# EasyEDA schematic SCH_Hytroponic_2022-08-30.json
TITLE: Sheet_1; REV: 1.0; Date: 2022-08-27; Sheet: 1/1; Drawn By: lykeosovandara4; Company: Your Company
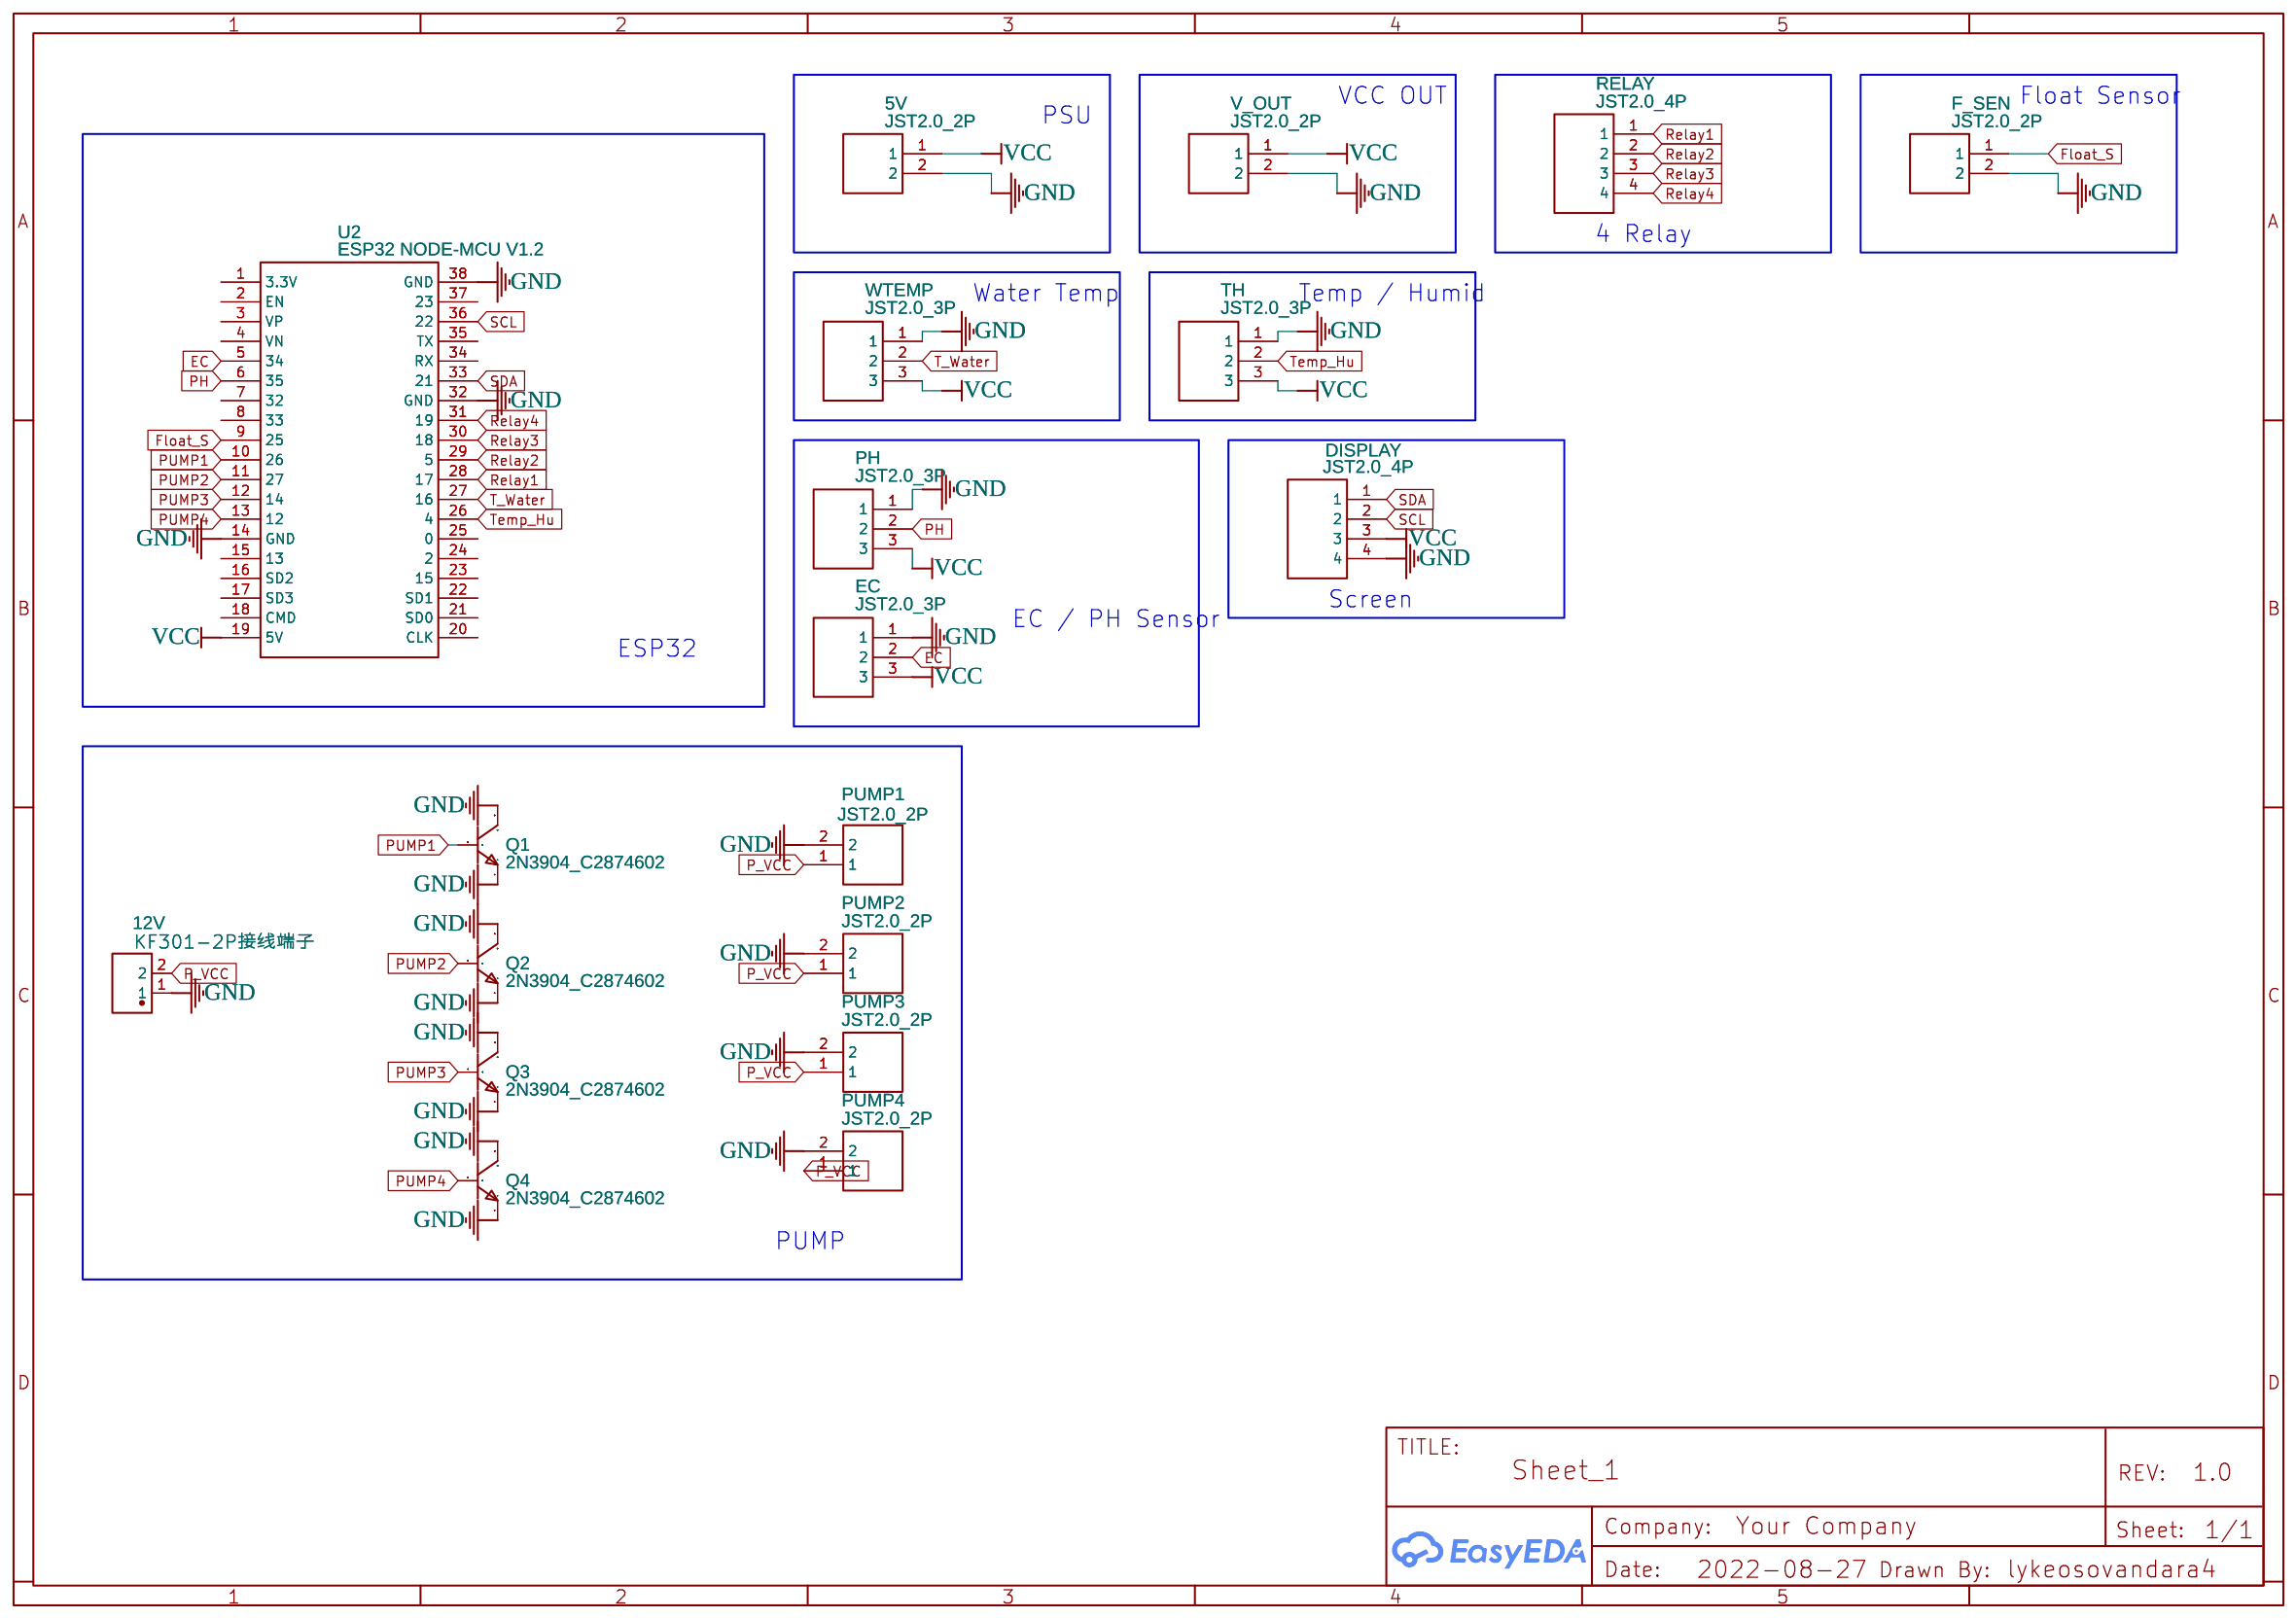
[diagram p0: schematic sheet]

## Parts
5V  JST2.0_2P  [JST2.0_2P]
12V  KF301-2P接线端子  [CONN-TH_XY301V-A-5.0-2P]
DISPLAY  JST2.0_4P  [JST2.0_4P]
EC  JST2.0_3P  [JST2.0_3P]
F_SEN  JST2.0_2P  [JST2.0_2P]
PH  JST2.0_3P  [JST2.0_3P]
PUMP1  JST2.0_2P  [JST2.0_2P]
PUMP2  JST2.0_2P  [JST2.0_2P]
PUMP3  JST2.0_2P  [JST2.0_2P]
PUMP4  JST2.0_2P  [JST2.0_2P]
Q1  2N3904_C2874602  [TO-92-3_L4.6-W3.6-P1.30-L_2N3904]
Q2  2N3904_C2874602  [TO-92-3_L4.6-W3.6-P1.30-L_2N3904]
Q3  2N3904_C2874602  [TO-92-3_L4.6-W3.6-P1.30-L_2N3904]
Q4  2N3904_C2874602  [TO-92-3_L4.6-W3.6-P1.30-L_2N3904]
RELAY  JST2.0_4P  [JST2.0_4P]
TH  JST2.0_3P  [JST2.0_3P]
U2  ESP32 NODE-MCU V1.2  [ESP32 NODE-MCU V1.2]
V_OUT  JST2.0_2P  [JST2.0_2P]
WTEMP  JST2.0_3P  [JST2.0_3P]

## Library data of the parts
5V F_SEN PUMP1-PUMP4 V_OUT = JST2.0_2P: Contributor: chentodd2012
12V = KF301-2P接线端子: Supplier: LCSC; Supplier Part: C9900016950; Manufacturer: null; JLCPCB Part Class: Extended Part; Contributor: lcsc
DISPLAY RELAY = JST2.0_4P: Contributor: chentodd2012
EC PH TH WTEMP = JST2.0_3P: Contributor: chentodd2012
Q1-Q4 = 2N3904_C2874602: Supplier: LCSC; Supplier Part: C2874602; Manufacturer: JSMSEMI(杰盛微); Manufacturer Part: 2N3904; Contributor: LCSC; JLCPCB Part Class: Extended Part
U2 = ESP32 NODE-MCU V1.2: Manufacturer: AI-THINKER; Contributor: somsaklai

## Nets
GND: 5V.2 12V.1 DISPLAY.4 EC.1 F_SEN.2 PH.1 PUMP1.2 PUMP2.2 PUMP3.2 PUMP4.2 Q1.1(E) Q1.3(C) Q2.1(E) Q2.3(C) Q3.1(E) Q3.3(C) Q4.1(E) Q4.3(C) TH.1 U2.14(GND) U2.32(GND) U2.38(GND) V_OUT.2 WTEMP.1
VCC: 5V.1 DISPLAY.3 EC.3 PH.3 TH.3 U2.19(5V) V_OUT.1 WTEMP.3
EC: EC.2 U2.5(34)
Float_S: F_SEN.1 U2.9(25)
P_VCC: 12V.2 PUMP1.1 PUMP2.1 PUMP3.1 PUMP4.1
PH: PH.2 U2.6(35)
PUMP1: Q1.2(B) U2.10(26)
PUMP2: Q2.2(B) U2.11(27)
PUMP3: Q3.2(B) U2.12(14)
PUMP4: Q4.2(B) U2.13(12)
Relay1: RELAY.1 U2.28(17)
Relay2: RELAY.2 U2.29(5)
Relay3: RELAY.3 U2.30(18)
Relay4: RELAY.4 U2.31(19)
SCL: DISPLAY.2 U2.36(22)
SDA: DISPLAY.1 U2.33(21)
T_Water: U2.27(16) WTEMP.2
Temp_Hu: TH.2 U2.26(4)

Not connected (* = marked no-connect by the designer): U2 1(3.3V) 2(EN) 3(VP) 4(VN) 7(32) 8(33) 15(13) 16(SD2) 17(SD3) 18(CMD) 20(CLK) 21(SD0) 22(SD1) 23(15) 24(2) 25(0) 34(RX) 35(TX) 37(23)

## Notes on the sheet
- VCC OUT
- Float Sensor
- PSU
- 4 Relay
- Water Temp
- Temp / Humid
- Screen
- EC / PH Sensor
- ESP32
- PUMP
